# EAGLE design Telemetria (EAGLE 9.6.2)
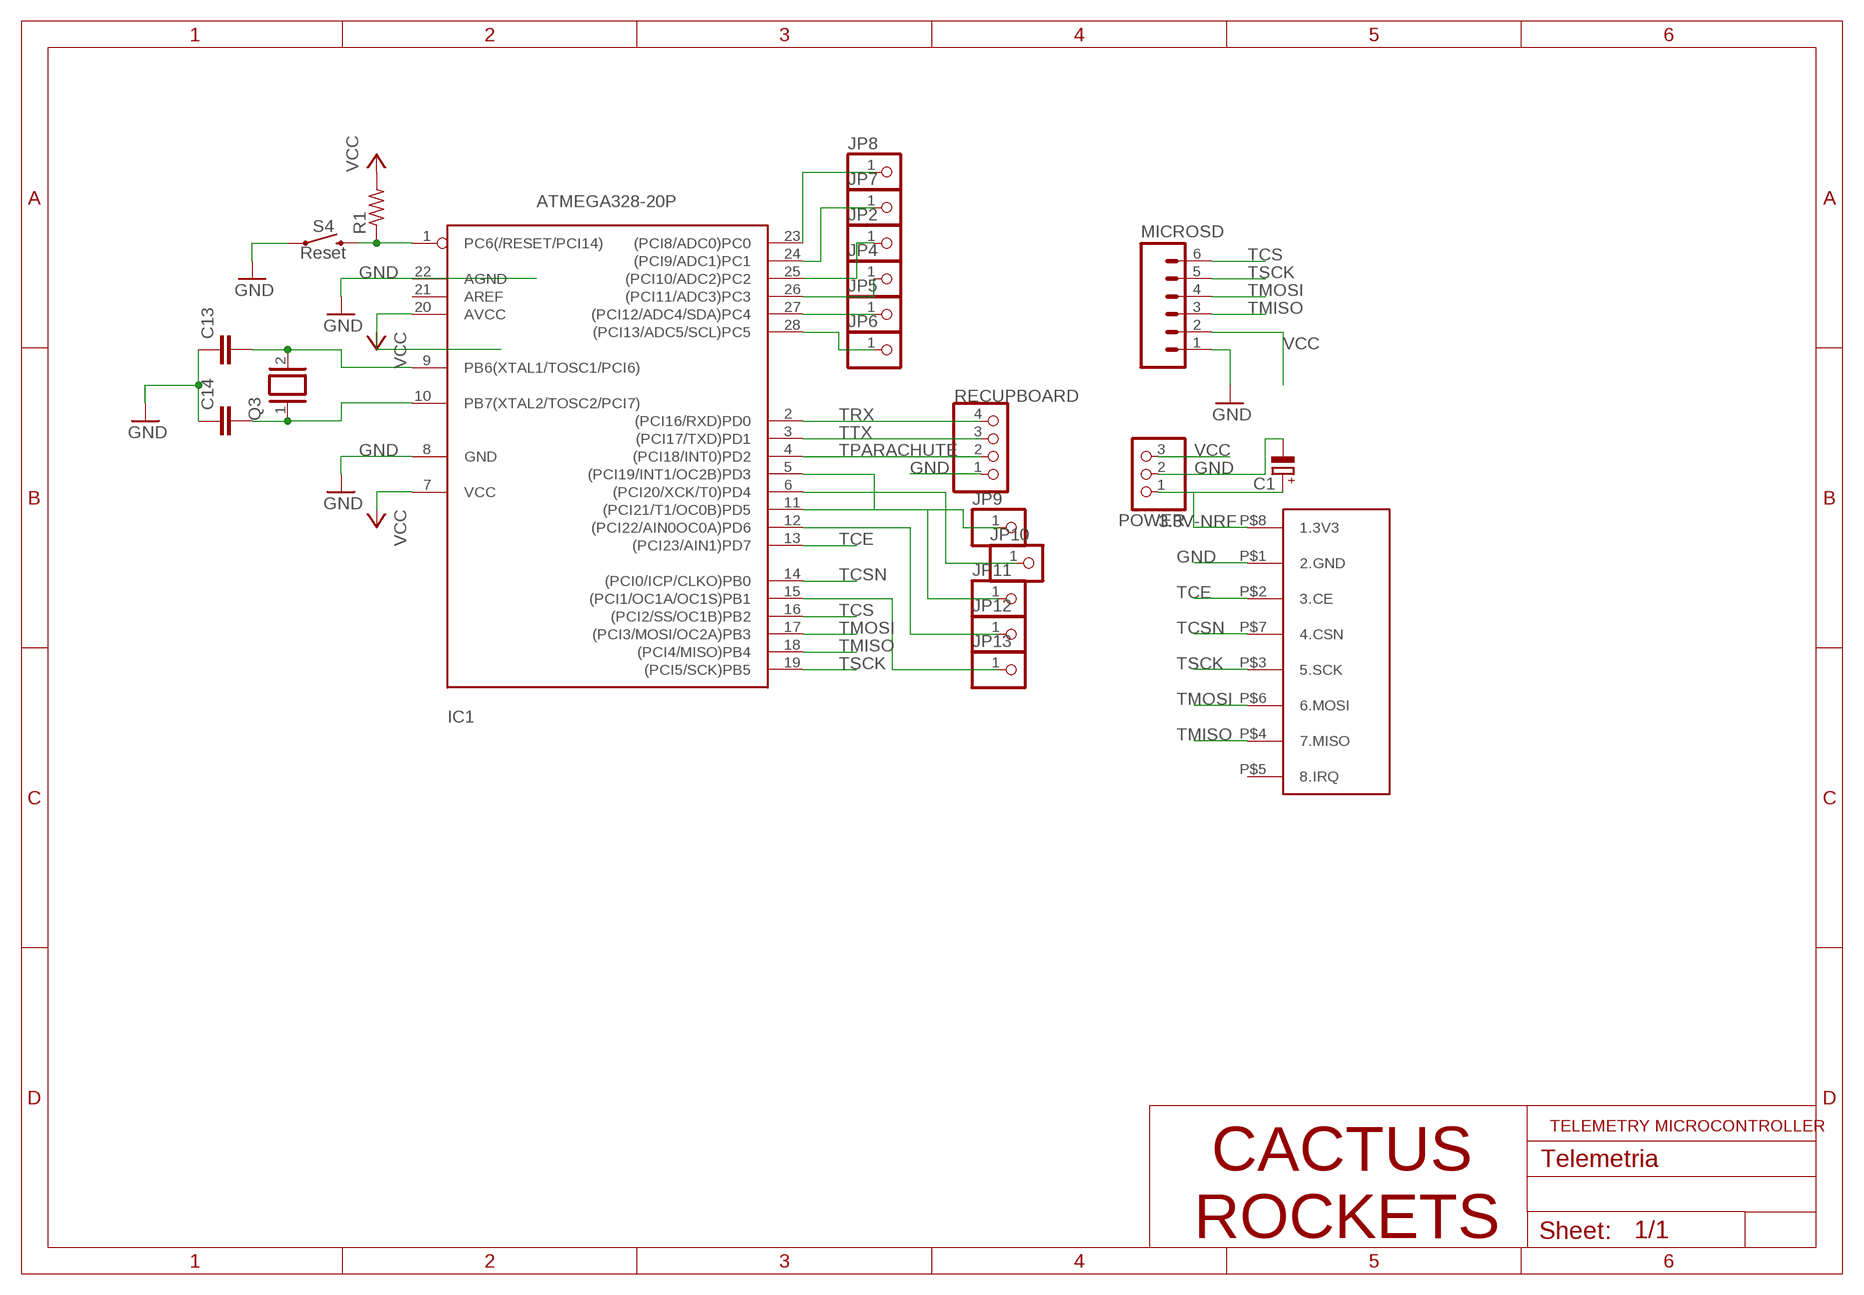
[diagram p0: schematic, sheet 1]

## Parts
C1  CPOL-EUE1.8-4  [E1,8-4]
C13  C-EU025-025X050  [C025-025X050]
C14  C-EU025-025X050  [C025-025X050]
IC1  ATMEGA328-20P  [DIL28-3]
JP2  PINHD-1X1  [1X01]
JP4  PINHD-1X1  [1X01]
JP5  PINHD-1X1  [1X01]
JP6  PINHD-1X1  [1X01]
JP7  PINHD-1X1  [1X01]
JP8  PINHD-1X1  [1X01]
JP9  PINHD-1X1  [1X01]
JP10  PINHD-1X1  [1X01]
JP11  PINHD-1X1  [1X01]
JP12  PINHD-1X1  [1X01]
JP13  PINHD-1X1  [1X01]
MICROSD  M06NO_SILK_FEMALE_PTH  [1X06_NO_SILK]
POWER  PINHD-1X3/90  [1X03/90]
Q3  XTAL/S  [QS]
R1  R-US_0207/10  [0207/10]
RECUPBOARD  PINHD-1X4/90  [1X04/90]
S4  Reset  MOMENTARY-SWITCH-SPST-PTH-6.0MM  [TACTILE_SWITCH_PTH_6.0MM]
U$1  NRF24L01+  [NRF24L01+]

## Nets
3.3V-NRF: C1.+ POWER.1 U$1.P$8(1.3V3)
GND: C1.- C13.1 C14.1 IC1.8(GND) IC1.22(AGND) MICROSD.1 POWER.2 RECUPBOARD.1 S4.1 S4.2 U$1.P$1(2.GND)
N$1: IC1.23((PCI8/ADC0)PC0) JP8.1
N$2: IC1.24((PCI9/ADC1)PC1) JP7.1
N$3: IC1.25((PCI10/ADC2)PC2) JP2.1
N$4: IC1.26((PCI11/ADC3)PC3) JP4.1
N$5: IC1.27((PCI12/ADC4/SDA)PC4) JP5.1
N$6: IC1.1(PC6(/RESET/PCI14)) R1.1 S4.3 S4.4
N$7: IC1.28((PCI13/ADC5/SCL)PC5) JP6.1
N$8: IC1.5((PCI19/INT1/OC2B)PD3) JP9.1
N$9: IC1.6((PCI20/XCK/T0)PD4) JP10.1
N$10: IC1.11((PCI21/T1/OC0B)PD5) JP11.1
N$11: IC1.12((PCI22/AIN0OC0A)PD6) JP12.1
N$12: IC1.15((PCI1/OC1A/OC1S)PB1) JP13.1
N$15: C14.2 IC1.10(PB7(XTAL2/TOSC2/PCI7)) Q3.1
N$16: C13.2 IC1.9(PB6(XTAL1/TOSC1/PCI6)) Q3.2
TCE: IC1.13((PCI23/AIN1)PD7) U$1.P$2(3.CE)
TCS: IC1.16((PCI2/SS/OC1B)PB2) MICROSD.6
TCSN: IC1.14((PCI0/ICP/CLKO)PB0) U$1.P$7(4.CSN)
TMISO: IC1.18((PCI4/MISO)PB4) MICROSD.3 U$1.P$4(7.MISO)
TMOSI: IC1.17((PCI3/MOSI/OC2A)PB3) MICROSD.4 U$1.P$6(6.MOSI)
TPARACHUTE: IC1.4((PCI18/INT0)PD2) RECUPBOARD.2
TRX: IC1.2((PCI16/RXD)PD0) RECUPBOARD.4
TSCK: IC1.19((PCI5/SCK)PB5) MICROSD.5 U$1.P$3(5.SCK)
TTX: IC1.3((PCI17/TXD)PD1) RECUPBOARD.3
VCC: IC1.7(VCC) IC1.20(AVCC) MICROSD.2 POWER.3 R1.2
Unconnected: IC1.21(AREF) U$1.P$5(8.IRQ)

## Notes on the sheet
- TELEMETRY MICROCONTROLLER
- CACTUS
  ROCKETS

## Library data of the parts
C1 = rcl:CPOL-EU: POLARIZED CAPACITOR, European symbol; SPICEPREFIX: C
C13 C14 = rcl:C-EU: CAPACITOR, European symbol; SPICEPREFIX: C
IC1 = atmega328:ATMEGA328*P: MICROCONTROLLER 32 kBytes FLASH 2 kBytes SRAM 1 kBytes EEPROM USART 8-channel 10 bit ADC
JP2 JP4-JP13 = pinhead:PINHD-1X1: PIN HEADER
MICROSD = SparkFun-Connectors:M06: Header 6 Standard 6-pin 0.1" header. Use with straight break away headers (SKU : PRT-00116), right angle break away headers (PRT-00553), swiss pins (PRT-00743), machine pins (PRT-00117), and female headers (PRT-00115). Molex polarized connector foot print use with SKU : PRT-08094 with associated crimp pins and housings. NOTES ON THE VARIANTS LOCK and LOCK_LONGPADS... This footprint was designed to help hold the alignment of a through-hole component (i.e. 6-pin header) while soldering it into place. You may notice that each hole has been shifted either up or down by 0.005 of an inch from it's more standard position (which is a perfectly straight line). This slight alteration caused the pins (the squares in the middle) to touch the edges of the holes. Because they are alternating, it causes a "brace" to hold the component in place. 0.005 has proven to be the perfect amount of "off-center" position when using our standard breakaway headers. Although looks a little odd when you look at the bare footprint, once you have a header in there, the alteration is very hard to notice. Also,if you push a header all the way into place, it is covered up entirely on the bottom side. This idea of altering the position of holes to aid alignment will be further integrated into the Sparkfun Library for other footprints. It can help hold any component with 3 or more connection pins.; PROD_ID: CONN-08437
POWER = pinhead:PINHD-1X3: PIN HEADER
Q3 = special:XTAL/S: CRYSTAL
R1 = rcl:R-US_: RESISTOR, American symbol; SPICEPREFIX: R
RECUPBOARD = pinhead:PINHD-1X4: PIN HEADER
S4 = SparkFun-Switches:MOMENTARY-SWITCH-SPST: Momentary Switch (Pushbutton) - SPST Normally-open (NO) SPST momentary switches (buttons, pushbuttons). Variants PTH-12MM - 12mm square, through-hole Momentary Pushbutton Switch - 12mm Square <https://www.sparkfun.com/products/9190> (COM-09190) PTH-6.0MM, PTH-6.0MM-KIT - 6.0mm square, through-hole Mini Pushbutton Switch <https://www.sparkfun.com/products/97> (COM-00097) KIT package intended for soldering kit's - only one side of pads' copper is exposed. PTH-RIGHT-ANGLE-KIT - Right-angle, through-hole Right Angle Tactile Button <https://www.sparkfun.com/products/10791> - Used on SparkFun BigTime Watch Kit <https://www.sparkfun.com/products/11734> SMD-12MM - 12mm square, surface-mount Tactile Button - SMD (12mm) <https://www.sparkfun.com/products/12993> (COM-12993) Used on SparkFun PicoBoard <https://www.sparkfun.com/products/11888> SMD-4.5MM - 4.5mm Square Trackball Switch Used on SparkFun Blackberry Trackballer Breakout <https://www.sparkfun.com/products/13169> SMD-4.6MMX2.8MM - 4.60mm x 2.80mm, surface mount Used on SparkFun Pro Micro - RP2040 <https://www.sparkfun.com/products/17717> SMD-5.2MM, SMD-5.2-REDUNDANT - 5.2mm square, surface-mount Mini Pushbutton Switch - SMD <https://www.sparkfun.com/products/8720> (COM-08720) Used on Arduino Pro Mini <https://www.sparkfun.com/products/11114> REDUNDANT package connects both switch circuits together SMD-6.0X3.5MM - 6.0 x 3.5mm, surface mount Momentary Reset Switch SMD <https://www.sparkfun.com/products/8229> (COM-08229) SMD-6.2MM-TALL - 6.2mm square, surface mount Tactile Button - SMD (6mm) <https://www.sparkfun.com/products/12992> Used on SparkFun Digital Sandbox <https://www.sparkfun.com/products/12651> SMD-RIGHT-ANGLE - Right-angle, surface mount Used on SparkFun Block for Intel® Edison - Arduino <https://www.sparkfun.com/products/13036>; PROD_ID: SWCH-08441; SF_SKU: COM-00097
U$1 = NRF24l01+:NRF24L01+

## Board
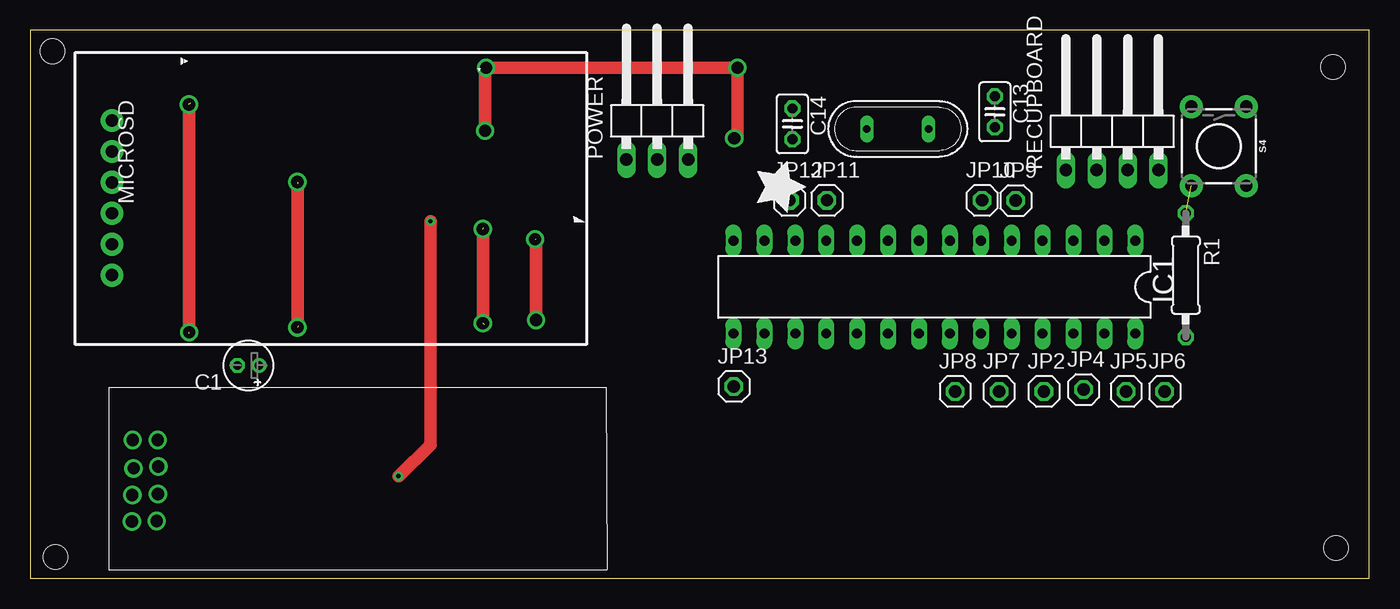
[diagram p1: board, top side]
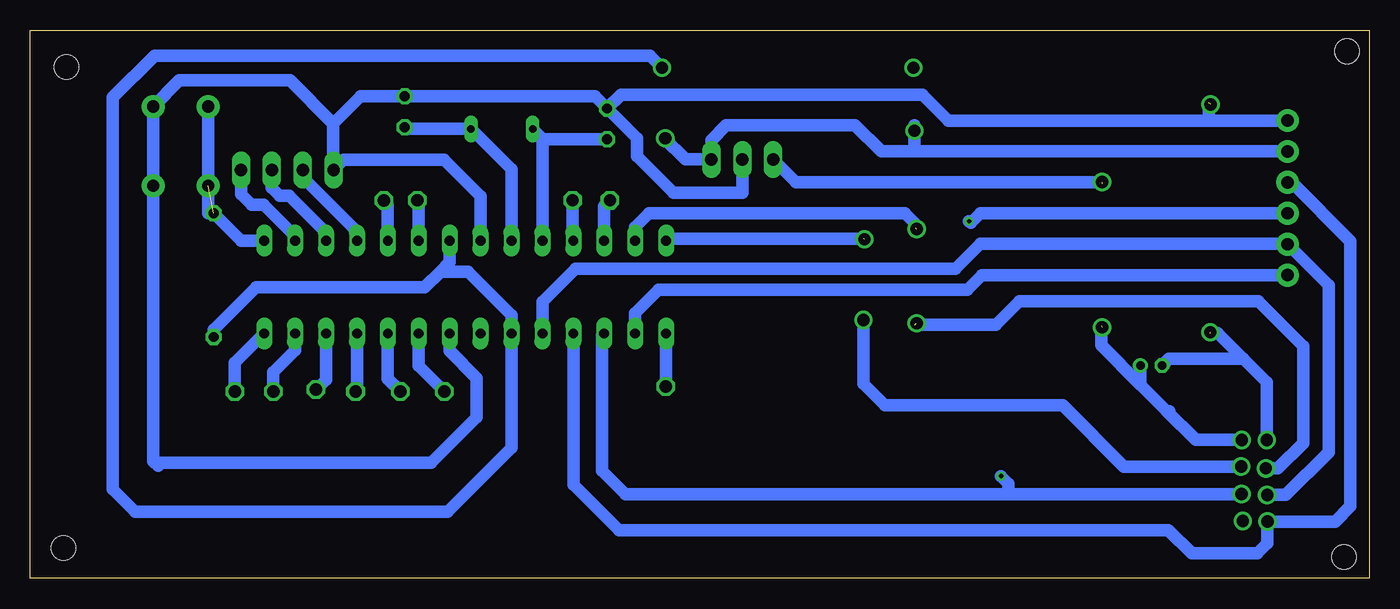
[diagram p2: board, bottom side, seen from below]

Size 110 x 45 mm. Coordinates in mm from the lower left corner, seen from the top.
Outline: 0,0 110,0 110,45 0,45 0,0
Copper layers (1*16): Top 0.035mm / dielectric 1.5mm / Bottom 0.035mm
Design rules "default": minimum track width 6mil, minimum drill 0.35mm, track to track 6mil, track to pad 6mil, pad to pad 6mil, via to via 6mil, smd to smd 6mil, copper to edge 40mil, drill to drill 6mil, minimum pad ring 10mil, minimum via ring 8mil, stop-mask expansion 4mil, vias tented up to drill 0mil, thermal gap 10mil
Holes 2 mm at 1.82,43.29 2.05,1.76 107.28,2.5 107.03,41.99

### Footprints (pad centres in the part's own frame; a part is rotated, then mirrored left to right if it is on the bottom)
E1,8-4 = drill 0.711 pad 1.168: + -0.889,0 | drill 0.711 pad 1.168 octagon: - 0.889,0
C025-025X050 = drill 0.813 octagon: 1 -1.27,0; 2 1.27,0
DIL28-3 = drill 0.813 long: 1 -16.51,-3.81; 2 -13.97,-3.81; 3 -11.43,-3.81; 4 -8.89,-3.81; 5 -6.35,-3.81; 6 -3.81,-3.81; 7 -1.27,-3.81; 8 1.27,-3.81; 9 3.81,-3.81; 10 6.35,-3.81; 11 8.89,-3.81; 12 11.43,-3.81; 13 13.97,-3.81; 14 16.51,-3.81; 15 16.51,3.81; 16 13.97,3.81; 17 11.43,3.81; 18 8.89,3.81; 19 6.35,3.81; 20 3.81,3.81; 21 1.27,3.81; 22 -1.27,3.81; 23 -3.81,3.81; 24 -6.35,3.81; 25 -8.89,3.81; 26 -11.43,3.81; 27 -13.97,3.81; 28 -16.51,3.81
1X01 = drill 1.016 octagon: 1 0,0
1X06_NO_SILK = drill 1.016 pad 1.88: 1 0,0; 2 2.54,0; 3 5.08,0; 4 7.62,0; 5 10.16,0; 6 12.7,0
1X03/90 = drill 1.016 long: 1 -2.54,-3.81; 2 0,-3.81; 3 2.54,-3.81
QS = drill 0.61 long: 1 -2.54,0; 2 2.54,0
0207/10 = drill 0.813 octagon: 1 -5.08,0; 2 5.08,0
1X04/90 = drill 1.016 long: 1 -3.81,-3.81; 2 -1.27,-3.81; 3 1.27,-3.81; 4 3.81,-3.81
TACTILE_SWITCH_PTH_6.0MM = drill 1.016 pad 1.88: 1 -3.251,2.261; 2 3.251,2.261; 3 -3.251,-2.261; 4 3.251,-2.261
NRF24L01+ = drill 1: P$1 4.318,1.956; P$2 6.655,2.032; P$3 8.839,1.93; P$4 11.024,1.905; P$5 10.973,3.937; P$6 8.763,4.039; P$7 6.502,4.064; P$8 4.318,4.013

### Placement (x,y rotation side)
C1  17.9,17.48 180 top
C13  79.24,38.31 270 top
C14  62.6,37.32 270 top
IC1  74.28,23.92 180 top
JP2  83.28,15.35 0 top
JP4  86.53,15.5 0 top
JP5  90.04,15.35 0 top
JP6  93.21,15.35 0 top
JP7  79.6,15.35 0 top
JP8  75.99,15.35 0 top
JP9  80.97,31.02 0 top
JP10  78.2,31.05 0 top
JP11  65.45,31.05 0 top
JP12  62.38,31.05 0 top
JP13  57.8,15.76 0 top
MICROSD  6.7,37.6 270 top
POWER  51.5,38.21 0 top
Q3  71.27,36.91 0 top
R1  94.94,24.9 270 top
RECUPBOARD  88.89,37.35 0 top
S4  97.66,35.49 270 top
U$1  6.44,15.68 270 top

### Tracks (layer width: path | path; a pad name or v marks a point on that pad's centre or on a via)
3.3V-NRF  (via drill 1)  (2 unrouted)
  Top 1.016: v21.94,32.55 v21.94,20.61
  Bottom 1.016: 11.98,11.36 U$1.P$8 14.24,11.36 16.6,13.72 | C1.+ 18.79,16.49 | 18.79,16.49 18.79,15.91 | 18.79,15.91 18.79,16.49 | 16.6,13.72 18.79,15.91 | 16.43,13.72 16.6,13.72 | 22.01,20.73 22.01,19.13 18.79,15.91 | POWER.1 47.11,32.55 22.07,32.55 21.94,32.42
GND  (via drill 1)  (2 unrouted)
  Top 1.016: v13.05,20.2 13.05,38.9 v13.02,38.92
  Bottom 1.016: C14.1 63.59,39.58 C13.1 82.87,39.58 85.11,37.35 | IC1.8 73.01,31.39 75.99,34.37 84.24,34.37 RECUPBOARD.1 85.11,33.56 85.11,37.35 | IC1.22 75.55,18.67 73.32,16.44 73.32,13.22 77.06,9.48 99.26,9.48 | 62.48,38.72 C14.1 | C14.1 60.17,36.15 60.17,34.68 57.14,31.66 51.5,31.66 POWER.2 | MICROSD.1 13.23,37.6 | U$1.P$1 8.4,16.11 10.33,18.04 | C1.- 16.45,18.04 10.33,18.04 | 99.26,9.48 99.79,9.48 99.92,9.61 S4.2 S4.1 97.76,40.9 88.66,40.9 85.11,37.35 | 99.48,9.25 99.26,9.48 | 13.23,37.6 13.15,37.68 13.15,39.05 | 13.23,37.6 34.56,37.6 36.7,39.73 61.46,39.73 C14.1 | 10.33,18.04 12.41,20.12 13.05,20.12
N$1
  Bottom 1.016: IC1.23 78.09,17.45 JP8.1
N$2
  Bottom 1.016: IC1.24 80.63,16.38 JP7.1
N$3
  Bottom 1.016: IC1.25 83.17,15.46 JP2.1
N$4
  Bottom 1.016: IC1.26 85.71,16.32 JP4.1
N$5
  Bottom 1.016: IC1.27 88.25,18.74 90.06,16.92 90.06,15.38 JP5.1
N$6  (1 unrouted)
  Bottom 1.016: IC1.1 92.69,27.73 R1.1 95.4,29.98 S4.3
N$7
  Bottom 1.016: IC1.28 93.21,17.69 JP6.1
N$8
  Bottom 1.016: IC1.5 80.63,30.68 JP9.1
N$9
  Bottom 1.016: IC1.6 78.09,30.94 JP10.1
N$10
  Bottom 1.016: IC1.11 65.45,27.79 JP11.1
N$11
  Bottom 1.016: IC1.12 62.85,30.57 JP12.1
N$12
  Bottom 1.016: JP13.1 57.77,15.79 IC1.15
N$15
  Bottom 1.016: C14.2 67.86,36.05 Q3.1 67.93,36.12 IC1.10
N$16
  Bottom 1.016: IC1.9 70.47,33.58 Q3.2 79.11,36.91 C13.2
TCE  (via drill 1)  (2 unrouted)
  Top 1.016: v37.18,20.94 v37.18,28.68
  Bottom 1.016: U$1.P$2 7.49,9.03 5.4,11.11 5.4,19.06 9.11,22.77 28.72,22.77 30.68,20.81 37.33,20.81 | IC1.13 60.31,28.82 59.15,29.98 38.14,29.98 37.08,28.91 37.22,28.77
TCS
  Bottom 1.016: IC1.16 60.31,21.78 58.39,23.71 33.01,23.71 31.82,24.9 MICROSD.6
TCSN  (via drill 1)  (1 unrouted)
  Top 1.016: v41.55,21.22 41.55,27.77 v41.47,27.85
  Bottom 1.016: 57.75,27.74 IC1.14 57.6,27.9 41.55,27.9 | 10.56,9.13 U$1.P$7 20.14,9.18 25.16,14.21 39.79,14.21 41.55,15.96 v41.55,21.22
TMISO
  Bottom 1.016: MICROSD.3 6.37,32.52 1.54,27.69 1.54,5.9 2.79,4.66 U$1.P$4 8.35,2.88 9.19,2.04 14.57,2.04 16.48,3.95 61.64,3.95 65.39,7.7 IC1.18
TMOSI  (via drill 0.35)
  Top 1.016: v32.87,29.33 32.87,10.97 30.27,8.36 v30.24,8.39
  Bottom 1.016: IC1.17 63.01,19.95 63.01,8.82 61.11,6.92 29.63,6.92 | v32.87,29.33 32.73,29.19 31.95,29.98 MICROSD.4 | U$1.P$6 29.63,6.92 | v30.24,8.39 29.63,7.78 29.63,6.92
TPARACHUTE
  Bottom 1.016: IC1.4 83.17,28.47 87.62,32.93 RECUPBOARD.2
TRX
  Bottom 1.016: IC1.2 88.25,28.09 90.85,30.69 91.84,30.69 92.7,31.55 RECUPBOARD.4
TSCK
  Bottom 1.016: U$1.P$3 6.83,6.84 3.32,10.35 3.32,24.06 MICROSD.5 6.72,27.47 31.95,27.47 33.98,25.43 65.19,25.43 67.93,22.7 IC1.19
TTX
  Bottom 1.016: IC1.3 85.71,28.4 88.74,31.43 89.5,31.43 90.16,32.09 RECUPBOARD.3
VCC  (via drill 1)
  Top 1.016: v37.36,36.76 37.36,41.87 v37.43,41.94 v58.11,41.94 58.11,36.43 v57.83,36.15
  Bottom 1.016: IC1.7 75.55,25.95 76.31,25.19 | R1.2 94.94,20.4 91.43,23.91 77.59,23.91 76.31,25.19 | 76.31,25.19 74.05,25.19 70.47,21.62 IC1.20 70.47,10.73 75.74,5.47 101.39,5.47 103.22,7.3 103.22,39.51 99.81,42.92 59.08,42.92 v58.11,41.94 | MICROSD.2 37.36,35.06 | 37.36,35.06 40.07,35.06 42.23,37.22 52.83,37.22 54.04,36 POWER.3 56.18,34.4 57.93,36.15 | 37.36,35.06 v37.36,36.76 37.36,37.22 | 58.29,42.12 v58.11,41.94 | v58.11,41.94 58.01,41.84